# EAGLE design HBridge_v1 (EAGLE 7.4.0)
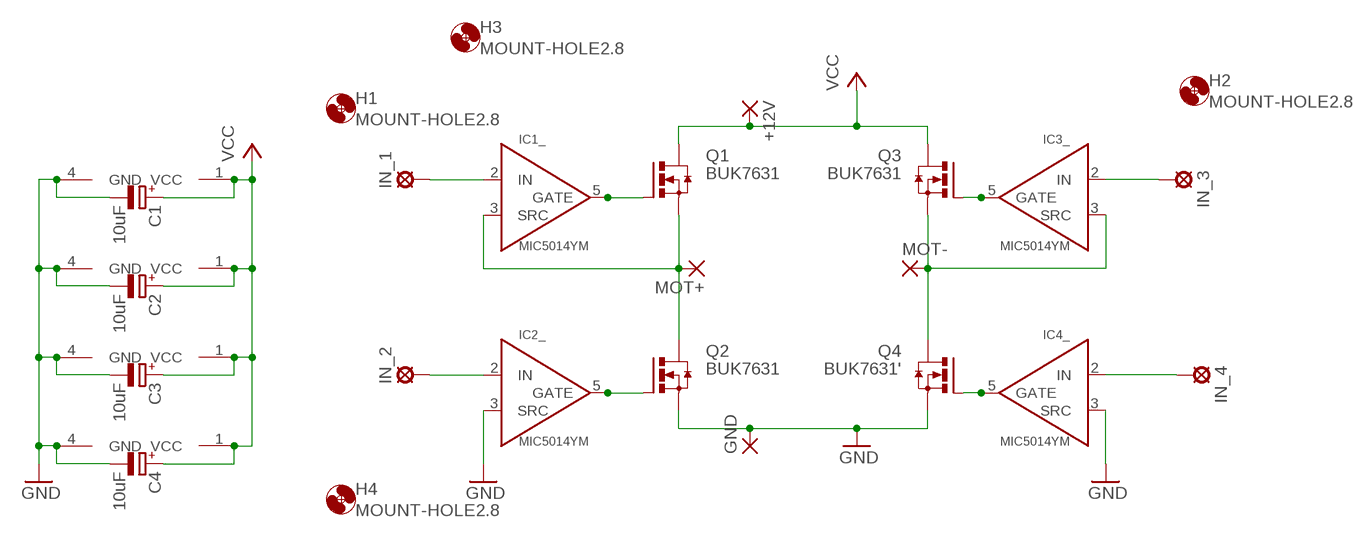
[diagram p0: schematic, sheet 1]

## Parts
+12V  WIREPAD4,16O1,6  [4,16O1,6]
C1  10uF  CPOL-EUUD-4X5,8  [UD-4X5,8_NICHICON]
C2  10uF  CPOL-EUUD-4X5,8  [UD-4X5,8_NICHICON]
C3  10uF  CPOL-EUUD-4X5,8  [UD-4X5,8_NICHICON]
C4  10uF  CPOL-EUUD-4X5,8  [UD-4X5,8_NICHICON]
GND  WIREPAD4,16O1,6  [4,16O1,6]
H1  MOUNT-HOLE2.8  [2,8]
H2  MOUNT-HOLE2.8  [2,8]
H3  MOUNT-HOLE2.8  [2,8]
H4  MOUNT-HOLE2.8  [2,8]
IC1  MIC5014YM  [SO8]
IC2  MIC5014YM  [SO8]
IC3  MIC5014YM  [SO8]
IC4  MIC5014YM  [SO8]
IN_1  LSP11  [LSP11]
IN_2  LSP11  [LSP11]
IN_3  LSP11  [LSP11]
IN_4  LSP11  [LSP11]
MOT+  WIREPAD4,16O1,6  [4,16O1,6]
MOT-  WIREPAD4,16O1,6  [4,16O1,6]
Q1  BUK7631  BUK7631-100EBUK7631-100E  [D2PAK_TO263]
Q2  BUK7631  BUK7631-100EBUK7631-100E  [D2PAK_TO263]
Q3  BUK7631  BUK7631-100EBUK7631-100E  [D2PAK_TO263]
Q4  BUK7631'  BUK7631-100EBUK7631-100E  [D2PAK_TO263]

## Nets
GND: C1.- C2.- C3.- C4.- GND.1(P) IC1.4(PWR:GND) IC2.3(_:SRC) IC2.4(PWR:GND) IC3.4(PWR:GND) IC4.3(_:SRC) IC4.4(PWR:GND) Q2.3(S) Q4.3(S)
MOT+: IC1.3(_:SRC) MOT+.1(P) Q1.3(S) Q2.4(D)
MOT-: IC3.3(_:SRC) MOT-.1(P) Q3.3(S) Q4.4(D)
N$1: IC4.2(_:IN) IN_4.MP
N$4: IC3.5(_:GATE) Q3.1(G)
N$6: IC1.2(_:IN) IN_1.MP
N$8: IC3.2(_:IN) IN_3.MP
N$9: IC2.2(_:IN) IN_2.MP
N$15: IC1.5(_:GATE) Q1.1(G)
N$97: IC4.5(_:GATE) Q4.1(G)
N$98: IC2.5(_:GATE) Q2.1(G)
VCC: +12V.1(P) C1.+ C2.+ C3.+ C4.+ IC1.1(PWR:VCC) IC2.1(PWR:VCC) IC3.1(PWR:VCC) IC4.1(PWR:VCC) Q1.4(D) Q3.4(D)

## Library data of the parts
+12V GND MOT+ MOT- = wirepad:WIREPAD: Wire PAD connect wire on PCB
C1-C4 = rcl:CPOL-EU: POLARIZED CAPACITOR, European symbol
H1-H4 = holes:MOUNT-HOLE: MOUNTING HOLE with drill center marker
IC1-IC4 = nervus:MIC5014: High or low side mosfet driver with integrated charge pump; OC_FARNELL: 1556756
IN_1-IN_4 = solpad:LSP11: SOLDER PAD drill 1.1 mm
Q1-Q4 = nervus:BUK7631-100E: N-channel TrenchMOS standard level FET 100 V, 34 A, 31 mΩ Datasheet <http://www.nxp.com/documents/data_sheet/BUK7631-100E.pdf>

## Net classes
0 default: width 0.254 mm, clearance 0.254 mm
1 HiCurrent: width 1.905 mm, clearance 0.508 mm

## Board
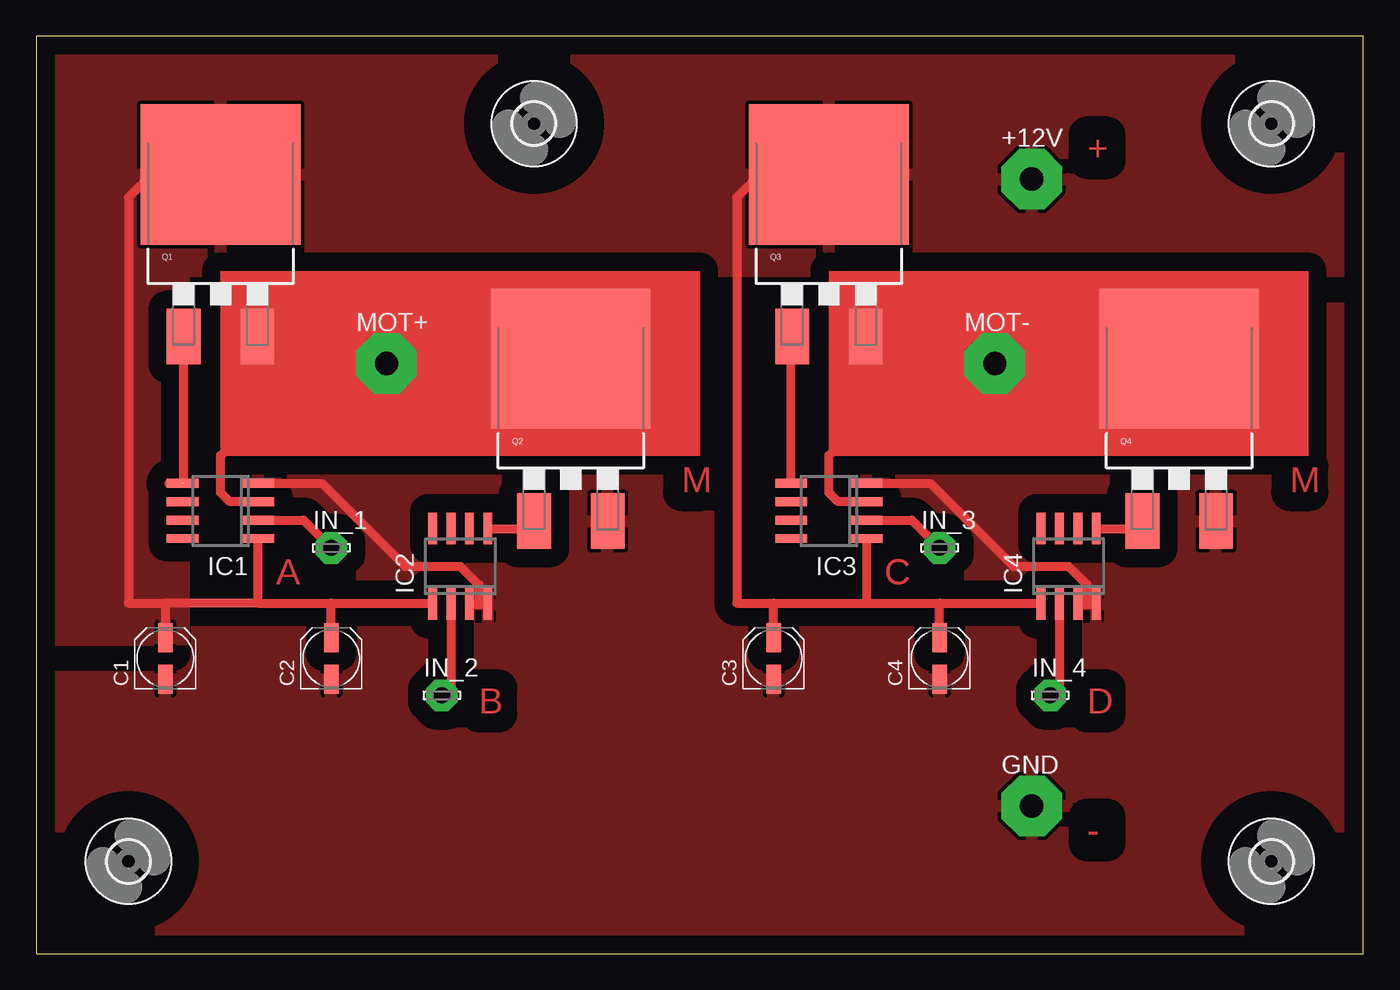
[diagram p1: board, top side]

Size 91.42 x 63.17 mm. Coordinates in mm from the lower left corner, seen from the top.
Outline: 0,0 91.42,0 91.42,63.17 0,63.17 0,0
Copper layers (1*16): Top 0.035mm / dielectric 1.5mm / Bottom 0.035mm
Design rules "default": minimum track width 10mil, minimum drill 24mil, track to track 8mil, track to pad 8mil, pad to pad 8mil, via to via 8mil, smd to smd 8mil, copper to edge 40mil, drill to drill 8mil, minimum pad ring 10mil, minimum via ring 8mil, stop-mask expansion 4mil, vias tented up to drill 0mil, thermal gap 10mil

### Footprints (pad centres in the part's own frame; a part is rotated, then mirrored left to right if it is on the bottom)
4,16O1,6 = drill 1.6 pad 4.166 octagon: 1 0,0
UD-4X5,8_NICHICON = smd 2 x 1: + 1.425,0; - -1.425,0
2,8 = hole 2.8: 0,0
SO8 = smd 0.6 x 2.2: 1 -1.905,-2.6; 2 -0.635,-2.6; 3 0.635,-2.6; 4 1.905,-2.6; 5 1.905,2.6; 6 0.635,2.6; 7 -0.635,2.6; 8 -1.905,2.6
LSP11 = drill 1.118 pad 2.159 octagon: MP 0,0
D2PAK_TO263 = smd 2.32 x 3.81: 1 -2.54,-7.045; 3 2.54,-7.045 | smd 11 x 9.65: 4 0,4.125

### Placement (x,y rotation side)
+12V  68.58,53.34 0 top
C1  8.89,20.32 90 top
C2  20.32,20.32 90 top
C3  50.8,20.32 90 top
C4  62.23,20.32 90 top
GND  68.58,10.16 0 top
H1  85.09,57.15 0 top
H2  85.09,6.35 0 top
H3  34.29,57.15 0 top
H4  6.35,6.35 0 top
IC1  12.7,30.48 90 top
IC2  29.21,26.67 0 top
IC3  54.61,30.48 90 top
IC4  71.12,26.67 0 top
IN_1  20.32,27.94 0 top
IN_2  27.94,17.78 0 top
IN_3  62.23,27.94 0 top
IN_4  69.85,17.78 0 top
MOT+  24.13,40.64 0 top
MOT-  66.04,40.64 0 top
Q1  12.7,49.53 0 top
Q2  36.83,36.83 0 top
Q3  54.61,49.53 0 top
Q4  78.74,36.83 0 top

### Tracks (layer width: path | path; a pad name or v marks a point on that pad's centre or on a via)
GND
  Top 0.61: IC1.4 19.69,32.38 25.4,26.67 29.21,26.67 30.48,25.4 30.48,24.07 | IC2.3 30.48,24.07 | 30.48,24.07 IC2.4 | IC3.4 61.59,32.38 67.31,26.67 71.12,26.67 72.39,25.4 72.39,24.07 | IC4.3 72.39,24.07 | 72.39,24.07 IC4.4
  pour Top (isolate 1.27): 8.89,44.45 91.44,44.45 91.44,0 0,0 0,19.05 8.89,19.05
MOT+
  Top 0.61: IC1.3 13.33,31.11 12.7,31.75 12.7,34.29 15.24,36.83 Q1.3 22.29,42.48 MOT+.1
  Top 0.813: MOT+.1 36.52,40.64 Q2.4
MOT-
  Top 0.61: IC3.3 55.24,31.11 54.61,31.75 54.61,34.29 55.88,35.56 55.88,41.22 Q3.3 64.19,42.48 MOT-.1
  Top 0.813: MOT-.1 78.42,40.64 Q4.4
N$1
  Top 0.61: IC4.2 70.48,18.41 IN_4.MP
N$4
  Top 0.61: IC3.5 52.01,42.42 Q3.1
N$6
  Top 0.61: IC1.2 18.42,29.84 IN_1.MP
N$8
  Top 0.61: IC3.2 60.33,29.84 IN_3.MP
N$9
  Top 0.61: IC2.2 28.57,18.41 IN_2.MP
N$15  (1 unrouted)
  Top 0.61: 9.15,32.38 10.16,32.38 Q1.1
  Top 0.813: Q1.1 10.1,42.48
N$97
  Top 0.61: IC4.5 75.69,29.27 Q4.1
N$98
  Top 0.61: IC2.5 33.77,29.27 Q2.1
VCC
  Top 0.61: IC1.1 15.24,28.57 15.24,24.13 | 15.24,24.13 8.89,24.13 | 8.89,24.13 C1.+ | Q1.4 7.93,53.66 6.35,52.07 6.35,24.13 8.89,24.13 | Q3.4 49.84,53.66 48.26,52.07 48.26,24.13 50.8,24.13 | 50.8,24.13 57.15,24.13 | 57.15,24.13 62.23,24.13 | 62.23,24.13 69.16,24.13 IC4.1 | IC3.1 57.21,24.19 57.15,24.13 | C4.+ 62.23,24.13 | C3.+ 50.8,24.13 | 15.24,24.13 20.32,24.13 | 20.32,24.13 27.3,24.13 IC2.1 | C2.+ 20.32,24.13
  pour Top (isolate 1.27): 0,63.5 91.44,63.5 91.44,46.99 10.16,46.99 10.16,21.59 0,21.59
(copper drawn outside any net)
  shapes: Top area x4

### Text on the board
Top: + | M | M | M | M | A | C | B | D | -